# EAGLE design Potenza (EAGLE 4.14)
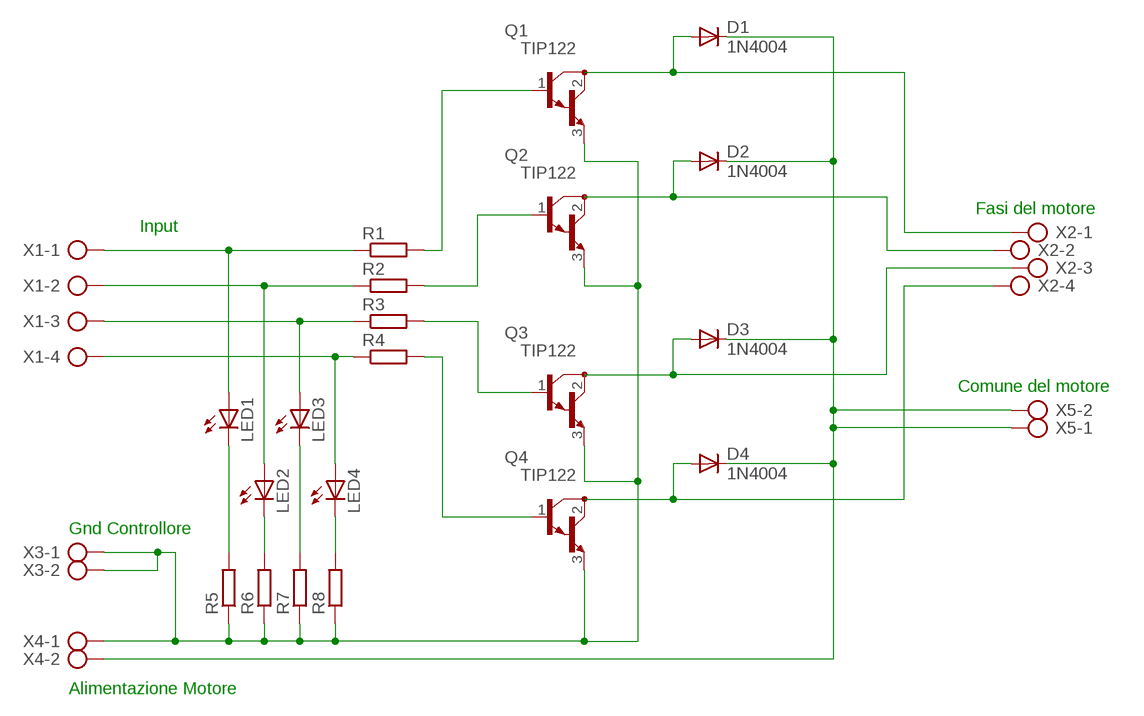
[diagram p0: schematic, sheet 1]

## Parts
D1  1N4004  [DO41-10]
D2  1N4004  [DO41-10]
D3  1N4004  [DO41-10]
D4  1N4004  [DO41-10]
LED1  LED3MM  [LED3MM]
LED2  LED3MM  [LED3MM]
LED3  LED3MM  [LED3MM]
LED4  LED3MM  [LED3MM]
Q1  TIP122  [TO220]
Q2  TIP122  [TO220]
Q3  TIP122  [TO220]
Q4  TIP122  [TO220]
R1  R-EU_0207/12  [0207/12]
R2  R-EU_0207/12  [0207/12]
R3  R-EU_0207/12  [0207/12]
R4  R-EU_0207/12  [0207/12]
R5  R-EU_0207/12  [0207/12]
R6  R-EU_0207/12  [0207/12]
R7  R-EU_0207/12  [0207/12]
R8  R-EU_0207/12  [0207/12]
X1  AK300/4  [AK300/4]
X2  AK300/4  [AK300/4]
X3  AK300/2  [AK300/2]
X4  AK300/2  [AK300/2]
X5  AK300/2  [AK300/2]

## Nets
N$1: LED1.A R1.1 X1.1
N$2: LED2.A R2.1 X1.2
N$3: LED4.A R4.1 X1.4
N$4: LED3.A R3.1 X1.3
N$5: Q1.1(B) R1.2
N$6: Q2.1(B) R2.2
N$7: Q3.1(B) R3.2
N$8: Q4.1(B) R4.2
N$9: Q1.3(E) Q2.3(E) Q3.3(E) Q4.3(E) R5.1 R6.1 R7.1 R8.1 X3.1 X3.2 X4.1
N$10: D1.A Q1.2(C) X2.1
N$11: D2.A Q2.2(C) X2.2
N$13: D3.A Q3.2(C) X2.3
N$14: D1.C D2.C D3.C D4.C X4.2 X5.1 X5.2
N$15: LED1.K(C) R5.2
N$16: LED2.K(C) R6.2
N$17: LED3.K(C) R7.2
N$18: LED4.K(C) R8.2
N$20: D4.A Q4.2(C) X2.4

## Notes on the sheet
- Fasi del motore
- Input
- Comune del motore
- Gnd Controllore
- Alimentazione Motore

## Library data of the parts
D1-D4 = diode:1N4004: DIODE general purpose rectifier, 1 A
LED1-LED4 = led:LED: LED OSRAM: - CHIPLED LG R971, LG N971, LY N971, LG Q971, LY Q971, LO R971, LY R971 LH N974, LH R974 LS Q976, LO Q976, LY Q976 LO Q996 - Hyper CHIPLED LW Q18S LB Q993, LB Q99A, LB R99A - SideLED LS A670, LO A670, LY A670, LG A670, LP A670 LB A673, LV A673, LT A673, LW A673 LH A674 LY A675 LS A676, LA A676, LO A676, LY A676, LW A676 LS A679, LY A679, LG A679 - Hyper Micro SIDELED® LS Y876, LA Y876, LO Y876, LY Y876 LT Y87S - SmartLED LW L88C, LW L88S LB L89C, LB L89S, LG L890 LS L89K, LO L89K, LY L89K LS L896, LA L896, LO L896, LY L896 - TOPLED LS T670, LO T670, LY T670, LG T670, LP T670 LSG T670, LSP T670, LSY T670, LOP T670, LYG T670 LG T671, LOG T671, LSG T671 LB T673, LV T673, LT T673, LW T673 LH T674 LS T676, LA T676, LO T676, LY T676, LB T676, LH T676, LSB T676, LW T676 LB T67C, LV T67C, LT T67C, LS T67K, LO T67K, LY T67K, LW E67C LS E67B, LA E67B, LO E67B, LY E67B, LB E67C, LV E67C, LT E67C LW T67C LS T679, LY T679, LG T679 LS T770, LO T770, LY T770, LG T770, LP T770 LB T773, LV T773, LT T773, LW T773 LH T774 LS E675, LA E675, LY E675, LS T675 LS T776, LA T776, LO T776, LY T776, LB T776 LHGB T686 LT T68C, LB T68C - Hyper Mini TOPLED® LB M676 - Mini TOPLED Santana® LG M470 LS M47K, LO M47K, LY M47K Source: http://www.osram.convergy.de/
Q1-Q4 = transistor-npn:TIP122*: NPN Darlington Transistor
R1-R8 = rcl:R-EU_: RESISTOR, European symbol
X1 X2 = con-ptr500:AK300/4: CONNECTOR
X3-X5 = con-ptr500:AK300/2: CONNECTOR

## Board
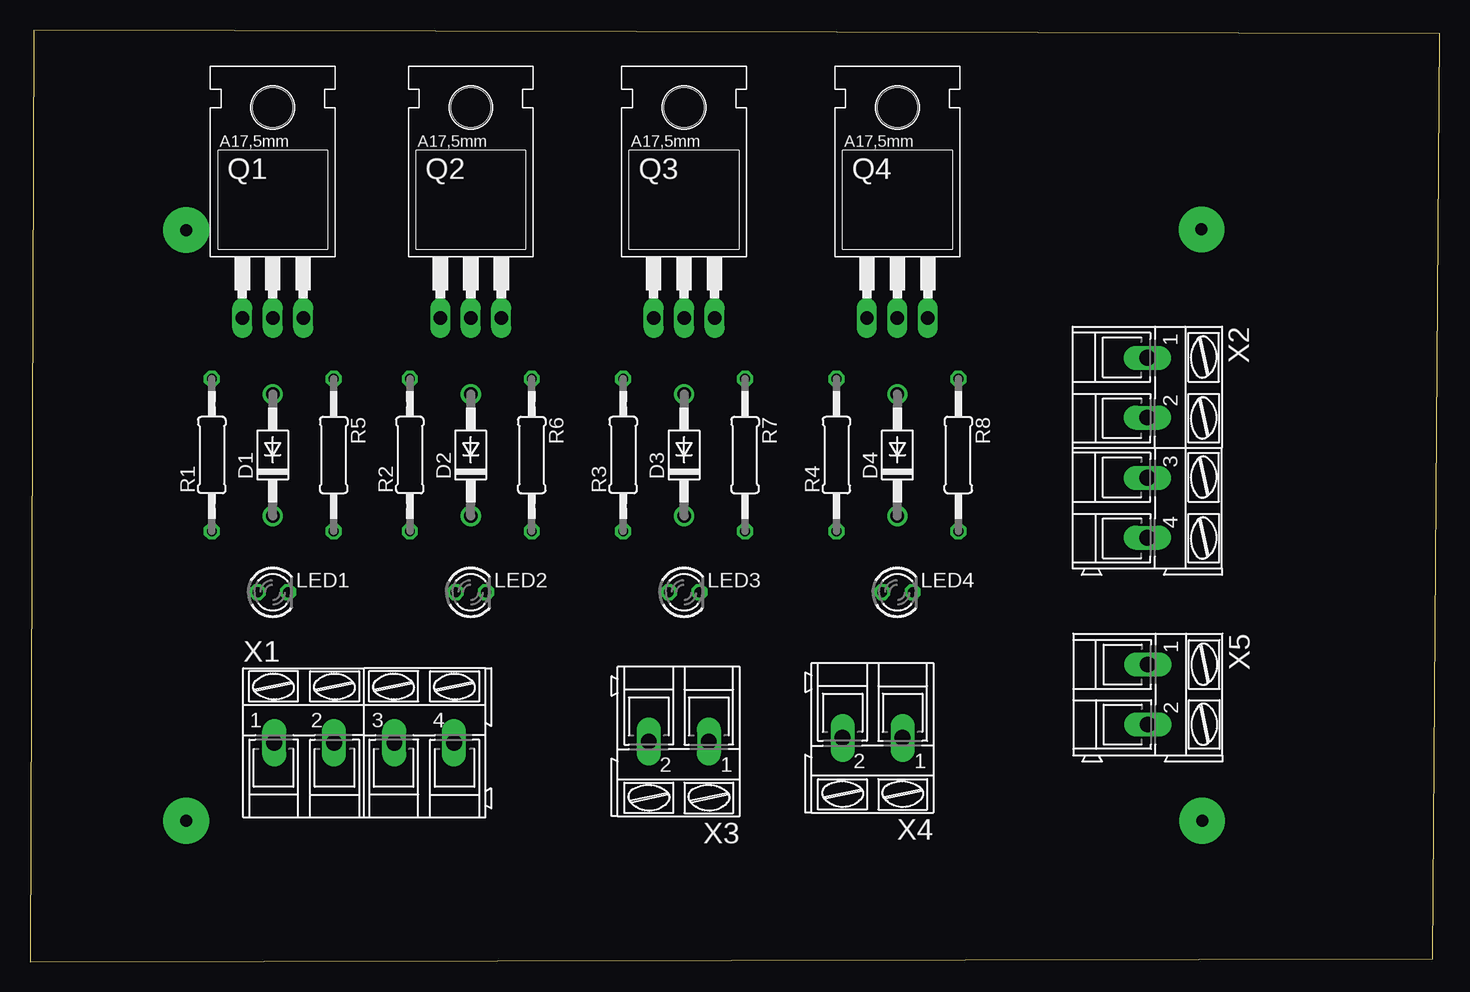
[diagram p1: board, top side]
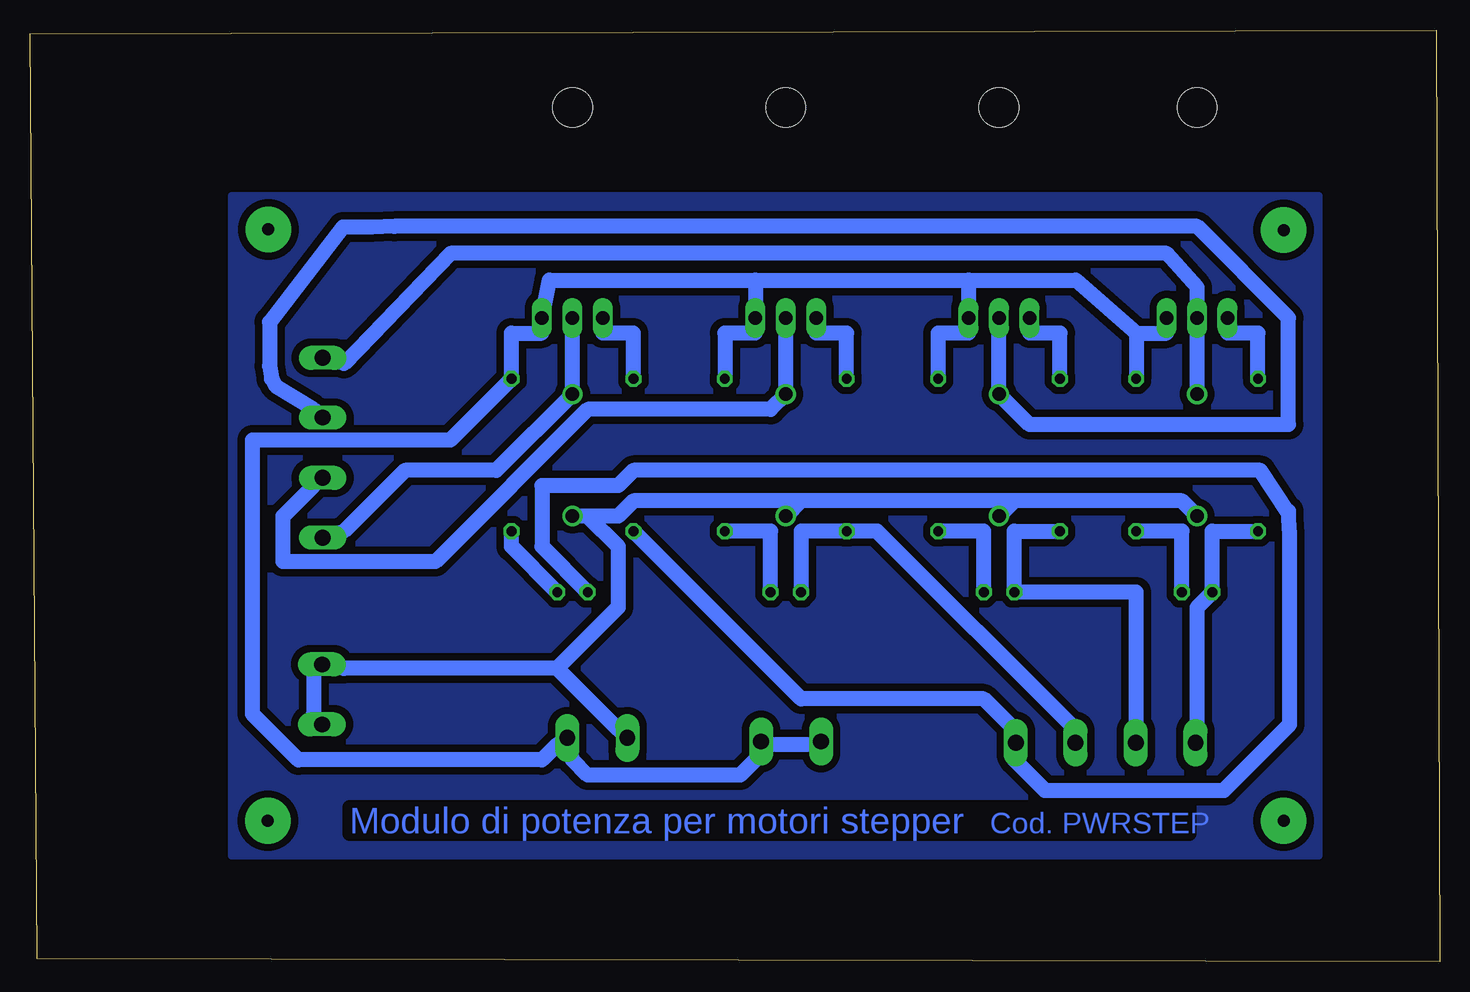
[diagram p2: board, bottom side, seen from below]

Size 117.53 x 77.65 mm. Coordinates in mm from the lower left corner, seen from the top.
Outline: 0,0 116.92,0.25 117.53,77.34 0.3,77.65 0,0
Copper layers (1*16): Top 0.035mm / dielectric 1.5mm / Bottom 0.035mm
Design rules "default": minimum track width 50mil, minimum drill 24mil, track to track 8mil, track to pad 8mil, pad to pad 8mil, via to via 8mil, smd to smd 8mil, copper to edge 40mil, drill to drill 8mil, minimum pad ring 10mil, minimum via ring 8mil, stop-mask expansion 4mil, vias tented up to drill 0mil, thermal gap 10mil

### Footprints (pad centres in the part's own frame; a part is rotated, then mirrored left to right if it is on the bottom)
DO41-10 = drill 1.118 round: A 5.08,0; C -5.08,0
LED3MM = drill 0.813 octagon: A -1.27,0; K 1.27,0
TO220 = drill 1.118 long: 1 -2.54,-6.35; 2 0,-6.35; 3 2.54,-6.35 | hole 3.302: 0,11.176
0207/12 = drill 0.813 octagon: 1 -6.35,0; 2 6.35,0
AK300/4 = drill 1.321 long: 1 -7.493,0; 2 -2.515,0; 3 2.515,0; 4 7.493,0
AK300/2 = drill 1.321 long: 1 -2.515,0; 2 2.489,0

### Placement (x,y rotation side)
D1  20.24,42.23 90 top
D2  36.75,42.23 90 top
D3  54.53,42.23 90 top
D4  72.31,42.23 90 top
LED1  20.24,30.8 0 top
LED2  36.75,30.8 0 top
LED3  54.53,30.8 0 top
LED4  72.31,30.8 0 top
Q1  20.24,60.01 0 top
Q2  36.75,60.01 0 top
Q3  54.53,60.01 0 top
Q4  72.31,60.01 0 top
R1  15.16,42.23 90 top
R2  31.67,42.23 90 top
R3  49.45,42.23 90 top
R4  67.23,42.23 90 top
R5  25.32,42.23 270 top
R6  41.83,42.23 270 top
R7  59.61,42.23 270 top
R8  77.39,42.23 270 top
X1  27.86,18.25 0 top
X2  93.14,42.84 270 top
X3  54.07,18.35 180 top
X4  70.23,18.66 180 top
X5  93.19,22.26 270 top

### Tracks (layer width: path | path; a pad name or v marks a point on that pad's centre or on a via)
N$1
  Bottom 1.27: R1.1 18.97,35.88 LED1.A 20.24,29.53 20.24,19.37 X1.1
N$2
  Bottom 1.27: R2.1 35.48,35.88 LED2.A 25.32,30.8 25.32,19.37 X1.2
N$3
  Bottom 1.27: R4.1 53.26,21.91 38.02,21.91 35.48,19.37 X1.4 35.48,16.83 32.94,14.29 18,14.29 12.52,19.77 12.52,35.62 12.62,37.55 12.62,37.4 14.96,40.96 67.23,40.96 68.5,39.69 74.85,39.69 74.85,34.61 LED4.A
N$4
  Bottom 1.27: LED3.A 53.26,35.88 R3.1 46.91,35.88 30.4,19.37 X1.3
N$5
  Bottom 1.27: R1.2 15.16,52.39 17.7,52.39 Q1.1
N$6
  Bottom 1.27: R2.2 31.67,52.39 34.21,52.39 Q2.1
N$7
  Bottom 1.27: R3.2 49.45,52.39 51.99,52.39 Q3.1
N$8
  Bottom 1.27: R4.2 67.23,52.39 69.77,52.39 Q4.1
N$9
  Bottom 1.27: X3.2 51.99,18.1 55.8,18.1 X3.1 57.07,16.83 58.34,15.56 71.04,15.56 72.31,16.83 X4.1 73.58,18.1 74.85,16.83 95.17,16.83 98.98,20.64 98.98,43.5 82.47,43.5 R8.1 77.39,52.39 74.85,52.39 Q4.3 74.24,56.81 57.07,56.81 | R7.1 59.61,52.39 57.07,52.39 Q3.3 57.07,56.81 | 25.32,52.39 R5.1 | 25.32,52.39 22.78,52.39 Q1.3 | R6.1 41.83,52.39 39.29,52.39 Q2.3 39.29,56.81 | 25.32,52.39 30.35,56.81 39.29,56.81 | 57.07,56.81 39.29,56.81
N$10
  Bottom 1.27: D1.A Q1.2 20.24,56.2 22.78,59.04 82.47,59.04 91.36,49.85 X2.1
N$11
  Bottom 1.27: Q2.2 D2.A 34.21,44.77 12.62,44.77 12.62,53.66 20.24,61.28 87.14,61.28 89.02,61.23 91.46,61.23 97.56,53.3 97.56,49.64 97.4,48.58 97.05,47.97 93.9,46.04 X2.2
N$12  (via drill 1 pad 3.81)
  other vias: 97.66,61.02
N$13
  Bottom 1.27: Q3.2 D3.A 55.8,46.04 71.04,46.04 83.74,33.34 96.44,33.34 96.44,37.15 93.9,39.69 X2.3
N$14
  Bottom 1.27: 73.58,24.45 68.5,19.37 X4.2 | 73.58,24.45 91.36,24.45 X5.1 93.9,24.45 93.9,20.64 X5.2 | D1.C 21.51,38.42 35.48,38.42 | 35.48,38.42 D2.C | 53.26,38.42 D3.C | 35.48,38.42 53.26,38.42 | 71.04,37.15 68.5,37.15 67.23,38.42 53.26,38.42 | 71.04,37.15 D4.C | 73.58,24.45 68.5,29.53 68.5,34.61 71.04,37.15
N$15
  Bottom 1.27: LED1.K 21.51,35.88 R5.2
N$16
  Bottom 1.27: LED2.K 38.02,35.88 R6.2
N$17
  Bottom 1.27: LED3.K 55.8,35.88 R7.2
N$18
  Bottom 1.27: LED4.K 77.39,34.61 R8.2
N$19  (via drill 1 pad 3.81)
  other vias: 13.03,11.75
N$20
  Bottom 1.27: Q4.2 D4.A 78.66,40.96 86.28,40.96 91.36,35.88 X2.4
N$21  (via drill 1 pad 3.81)
  other vias: 13.03,60.97
N$22  (via drill 1 pad 3.81)
  other vias: 97.71,11.75
N$23
  pour Bottom (isolate 0.61): 10.08,63.82 100.71,63.82 100.71,8.85 10.08,8.85

### Text on the board
Bottom: Cod. PWRSTEP | Modulo di potenza per motori stepper